# Altium schematic sheet pokey.SchDoc
size A
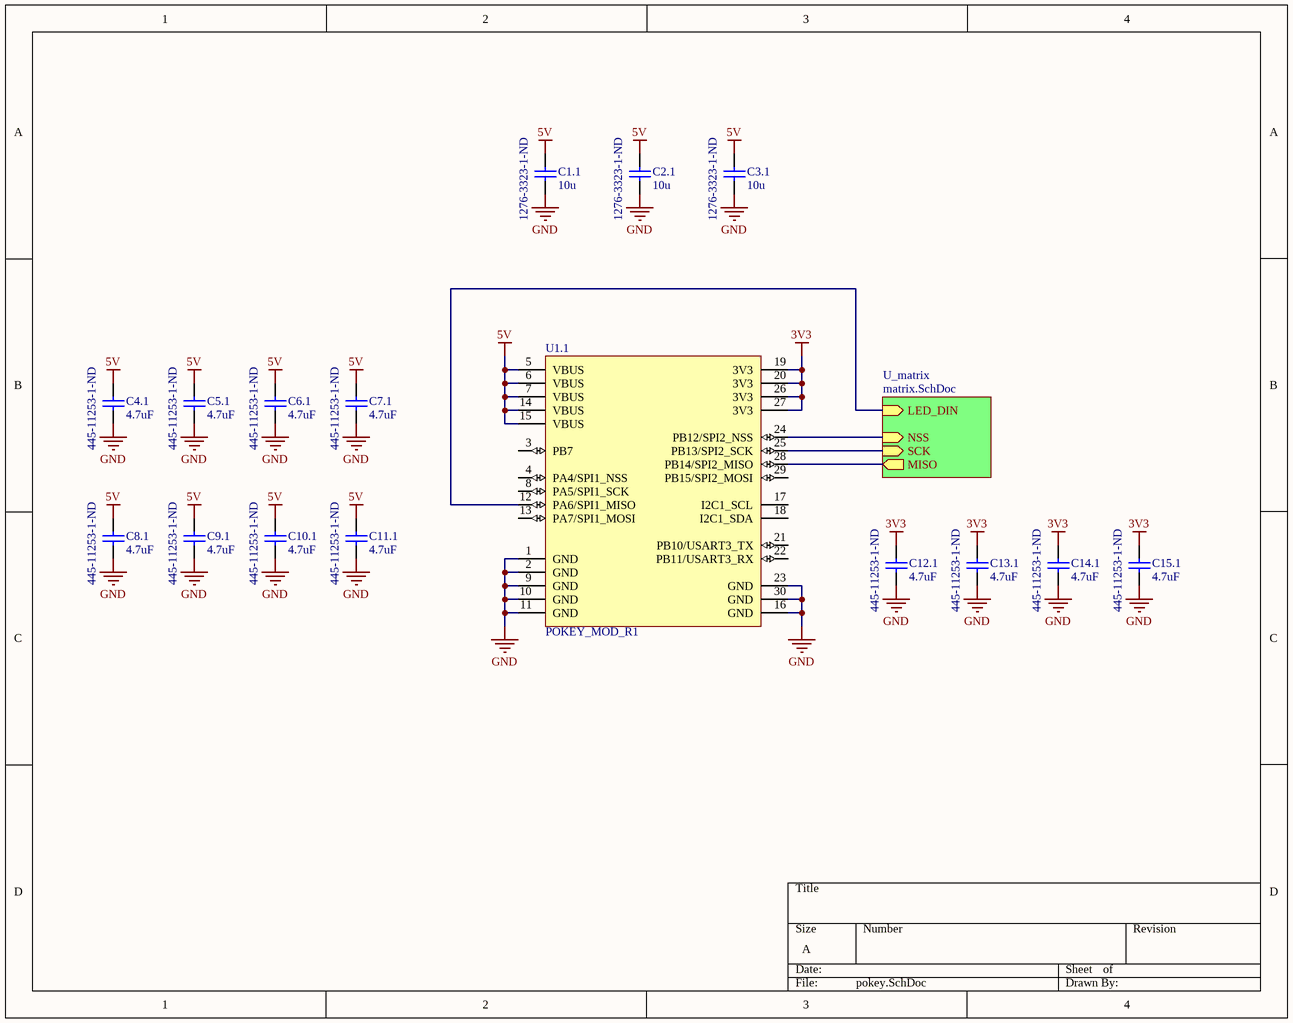
[diagram p0: pokey.SchDoc]

## Parts
C1.1  Supplier Part Number 1: 1276-3323-1-ND  [1210]  (hidden comment: 10u)
C2.1  Supplier Part Number 1: 1276-3323-1-ND  [1210]  (hidden comment: 10u)
C3.1  Supplier Part Number 1: 1276-3323-1-ND  [1210]  (hidden comment: 10u)
C4.1  4.7uF  Supplier Part Number 1: 445-11253-1-ND  [1608[0603]]
C5.1  4.7uF  Supplier Part Number 1: 445-11253-1-ND  [1608[0603]]
C6.1  4.7uF  Supplier Part Number 1: 445-11253-1-ND  [1608[0603]]
C7.1  4.7uF  Supplier Part Number 1: 445-11253-1-ND  [1608[0603]]
C8.1  4.7uF  Supplier Part Number 1: 445-11253-1-ND  [1608[0603]]
C9.1  4.7uF  Supplier Part Number 1: 445-11253-1-ND  [1608[0603]]
C10.1  4.7uF  Supplier Part Number 1: 445-11253-1-ND  [1608[0603]]
C11.1  4.7uF  Supplier Part Number 1: 445-11253-1-ND  [1608[0603]]
C12.1  4.7uF  Supplier Part Number 1: 445-11253-1-ND  [1608[0603]]
C13.1  4.7uF  Supplier Part Number 1: 445-11253-1-ND  [1608[0603]]
C14.1  4.7uF  Supplier Part Number 1: 445-11253-1-ND  [1608[0603]]
C15.1  4.7uF  Supplier Part Number 1: 445-11253-1-ND  [1608[0603]]
U1.1  POKEY_MOD_R1  [POKEY_MOD_R1]

## Sub-sheets
U_matrix = matrix.SchDoc: LED_DIN (in), SCK (in), MISO (out), NSS (in)

## Nets
3V3: C12.1.2 C13.1.2 C14.1.2 C15.1.2 U1.1.19(3V3) U1.1.20(3V3) U1.1.26(3V3) U1.1.27(3V3)
5V: C1.1.2 C2.1.2 C3.1.2 C4.1.2 C5.1.2 C6.1.2 C7.1.2 C8.1.2 C9.1.2 C10.1.2 C11.1.2 U1.1.5(VBUS) U1.1.6(VBUS) U1.1.7(VBUS) U1.1.14(VBUS) U1.1.15(VBUS)
GND: C1.1.1 C2.1.1 C3.1.1 C4.1.1 C5.1.1 C6.1.1 C7.1.1 C8.1.1 C9.1.1 C10.1.1 C11.1.1 C12.1.1 C13.1.1 C14.1.1 C15.1.1 U1.1.1(GND) U1.1.2(GND) U1.1.9(GND) U1.1.10(GND) U1.1.11(GND) U1.1.16(GND) U1.1.23(GND) U1.1.30(GND)
NetU1.1_12: U1.1.12(PA6/SPI1_MISO) ; sheet U_matrix/LED_DIN
NetU1.1_24: U1.1.24(PB12/SPI2_NSS) ; sheet U_matrix/NSS
NetU1.1_25: U1.1.25(PB13/SPI2_SCK) ; sheet U_matrix/SCK
NetU1.1_28: U1.1.28(PB14/SPI2_MISO) ; sheet U_matrix/MISO

Not connected (* = marked no-connect by the designer): U1.1 3(PB7) 4(PA4/SPI1_NSS) 8(PA5/SPI1_SCK) 13(PA7/SPI1_MOSI) 17(I2C1_SCL) 18(I2C1_SDA) 21(PB10/USART3_TX) 22(PB11/USART3_RX) 29(PB15/SPI2_MOSI)

## Library data of the parts
C1.1 C2.1 C3.1 = CAPACITOR NON_POL: Material: Ceramic; Capacitance: 10uF; Tolerance: 10%; Dielectric: X7R; Voltage Rating: 35V; Value: 10u; ComponentLink1URL: http://www.murata.com/~/media/webrenewal/support/library/catalog/products/capacitor/mlcc/c02e.ashx; ComponentLink1Description: http://www.murata.com/~/media/webrenewal/support/library/catalog/products/capacitor/mlcc/c02e.ashx; Supplier 1: Digi-Key; Stock 1: 421732; Pricing 1: 1 = 0.81000, 10 = 0.57000, 100 = 0.37510, 500 = 0.27788, 1000 = 0.23619 (USD); RoHS: Yes; Mount: Surface Mount; Case/Package: 1210; Case Code (Metric): 3225; Case Code (Imperial): 1210; Min Operating Temperature: -55°C; Max Operating Temperature: 125°C; Package Quantity: 1; Packaging: Tape and Reel; Voltage: 35V; Length: 3.2mm; Height: 1.8mm; Depth: 2.5mm; Width: 0.098inch; Thickness: 0.079inch; Radiation Hardening: No; Lead Free: Lead Free; ComponentLink2URL: https://datasheet.ciiva.com/25724/cl32b106klulnne-25724000.pdf?src-supplier=Digi-Key; ComponentLink2Description: https://datasheet.ciiva.com/25724/cl32b106klulnne-25724000.pdf?src-supplier=Digi-Key; ComponentLink3URL: https://datasheet.ciiva.com/15196/getdatasheetpartid-353216-15196149.pdf?src-supplier=Verical; ComponentLink3Description: https://datasheet.ciiva.com/15196/getdatasheetpartid-353216-15196149.pdf?src-supplier=Verical; ComponentLink4URL: https://datasheet.ciiva.com/29202/450840-da-01-en-vs-kondensator-1210-29202828.pdf?src-supplier=Conrad; ComponentLink4Description: https://datasheet.ciiva.com/29202/450840-da-01-en-vs-kondensator-1210-29202828.pdf?src-supplier=Conrad
C4.1 C5.1 C6.1 C7.1 C8.1 C9.1 C10.1 C11.1 C12.1 C13.1 C14.1 C15.1 = C0402: Value: 4.7uF; Supplier 1: Digi-Key